# Altium schematic sheet H18R1_Frontend 1_backup.SchDoc
size Letter; CompanyName: Hexabitz; DocumentNumber: 2; SheetNumber: 2; SheetTotal: 3
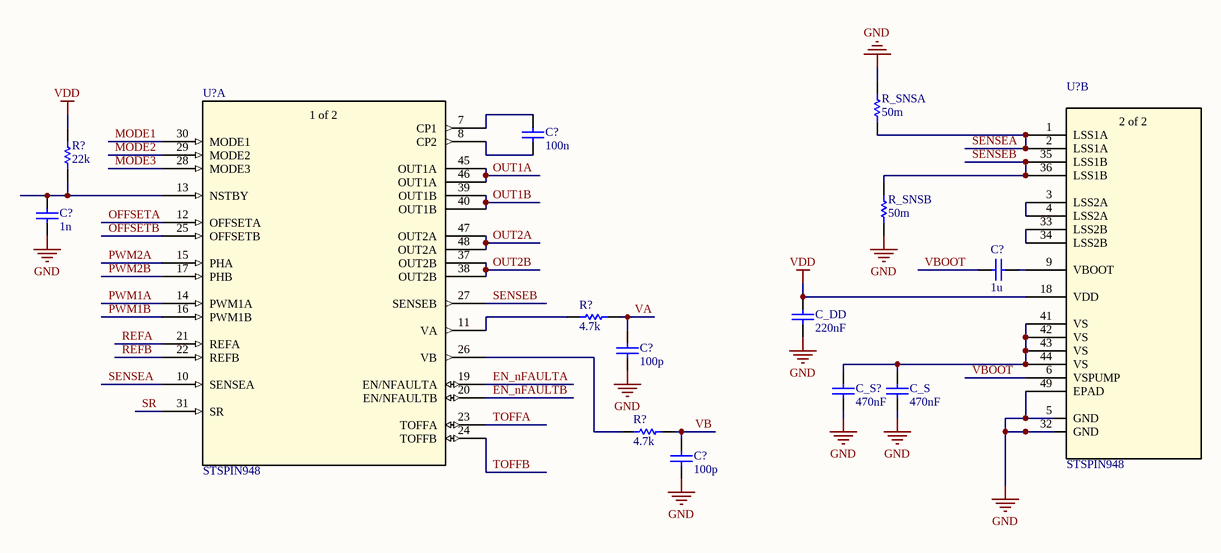
[diagram p0: H18R1_Frontend 1_backup.SchDoc]

## Parts
(Parts that share a designator on the sheet are numbered #1, #2 ... from top to bottom, then left to right.)
C?#1  value 100n  (hidden comment: Capacitor)
C?#2  value 1n  (hidden comment: Capacitor)
C?#3  value 1u  (hidden comment: Capacitor)
C?#4  value 100p  (hidden comment: Capacitor)
C?#5  value 100p  (hidden comment: Capacitor)
C_DD  value 220nF  (hidden comment: Capacitor)
C_S  value 470nF  (hidden comment: Capacitor)
C_S?  value 470nF  (hidden comment: Capacitor)
R?#1  value 22k  (hidden comment: Resistor)
R?#2  value 4.7k  (hidden comment: Resistor)
R?#3  value 4.7k  (hidden comment: Resistor)
R_SNSA  value 50m  (hidden comment: Resistor)
R_SNSB  value 50m  (hidden comment: Resistor)
U?#1  STSPIN948  [VFQFPN48_7P15X7P15X0P5_STM]  (part B of 2)
U?#2  STSPIN948  [VFQFPN48_7P15X7P15X0P5_STM]  (part A of 2)

## Nets
GND: C?#2.2 C?#4.1 C?#5.1 C_DD.2 C_S.2 C_S?.2 R_SNSA.1 R_SNSB.1 U?#1.5(GND) U?#1.32(GND) U?#1.49(EPAD)
VDD: C_DD.1 R?#1.1 U?#1.18(VDD)
EN_nFAULTA: U?#2.19(EN/NFAULTA)
EN_nFAULTB: U?#2.20(EN/NFAULTB)
MODE1: U?#2.30(MODE1)
MODE~{2}: U?#2.29(MODE2)
MODE3: U?#2.28(MODE3)
OFFSETA: U?#2.12(OFFSETA)
OFFSETB: U?#2.25(OFFSETB)
OUT1A: U?#2.45(OUT1A) U?#2.46(OUT1A)
OUT1B: U?#2.39(OUT1B) U?#2.40(OUT1B)
OUT2A: U?#2.47(OUT2A) U?#2.48(OUT2A)
OUT2B: U?#2.37(OUT2B) U?#2.38(OUT2B)
PWM1A: U?#2.14(PWM1A)
PWM1B: U?#2.16(PWM1B)
PWM2A: U?#2.15(PHA)
PWM2B: U?#2.17(PHB)
REFA: U?#2.21(REFA)
REFB: U?#2.22(REFB)
SENSEA: R_SNSA.2 U?#1.1(LSS1A) U?#1.2(LSS1A) U?#2.10(SENSEA)
SENSEB: R_SNSB.2 U?#1.35(LSS1B) U?#1.36(LSS1B) U?#2.27(SENSEB)
SR: U?#2.31(SR)
TOFFA: U?#2.23(TOFFA)
TOFFB: U?#2.24(TOFFB)
VA: C?#4.2 R?#2.2
VB: C?#5.2 R?#3.2
VBOOT: C?#3.2 U?#1.6(VSPUMP)
NetC?#1_1: C?#1.1 U?#2.7(CP1)
NetC?#1_2: C?#1.2 U?#2.8(CP2)
NetC?#2_1: C?#2.1 R?#1.2 U?#2.13(NSTBY)
NetC?#3_1: C?#3.1 U?#1.9(VBOOT)
NetC_S_1: C_S.1 C_S?.1 U?#1.41(VS) U?#1.42(VS) U?#1.43(VS) U?#1.44(VS)
NetR?#2_1: R?#2.1 U?#2.11(VA)
NetR?#3_1: R?#3.1 U?#2.26(VB)
NetU?#1_3: U?#1.3(LSS2A) U?#1.4(LSS2A)
NetU?#1_33: U?#1.33(LSS2B) U?#1.34(LSS2B)

## Notes on the sheet
- Module:
- Title:
- Description:
- Size:
- Revision:
- Letter
- www.hexabitz.com
- Date:
- Time:
- Sheet
- of
- (in symbol STSPIN948, part A) 1 of 2
- (in symbol STSPIN948, part B) 2 of 2

## Library data of the parts
C?#1-C?#5 C_DD C_S C_S? = Capacitor: SimulationGenericComponent: True
R?#1-R?#3 R_SNSA R_SNSB = Resistor: TC1: 0; SimulationGenericComponent: True; TC2: 0
U?#1 U?#2 = STSPIN948: Scalable 4.5 A dual full-bridge driver for brushed DC motors; Manufacturer_Name: STMicroelectronics; Type: Power Management; Copyright: Copyright (C) 2025 Ultra Librarian. All rights reserved.; Manufacturer_Part_Number: STSPIN948; Datasheet: https://www.st.com/resource/en/datasheet/stspin948.pdf; RefDes: RefDes